# EAGLE design micro430 (EAGLE 5.11)
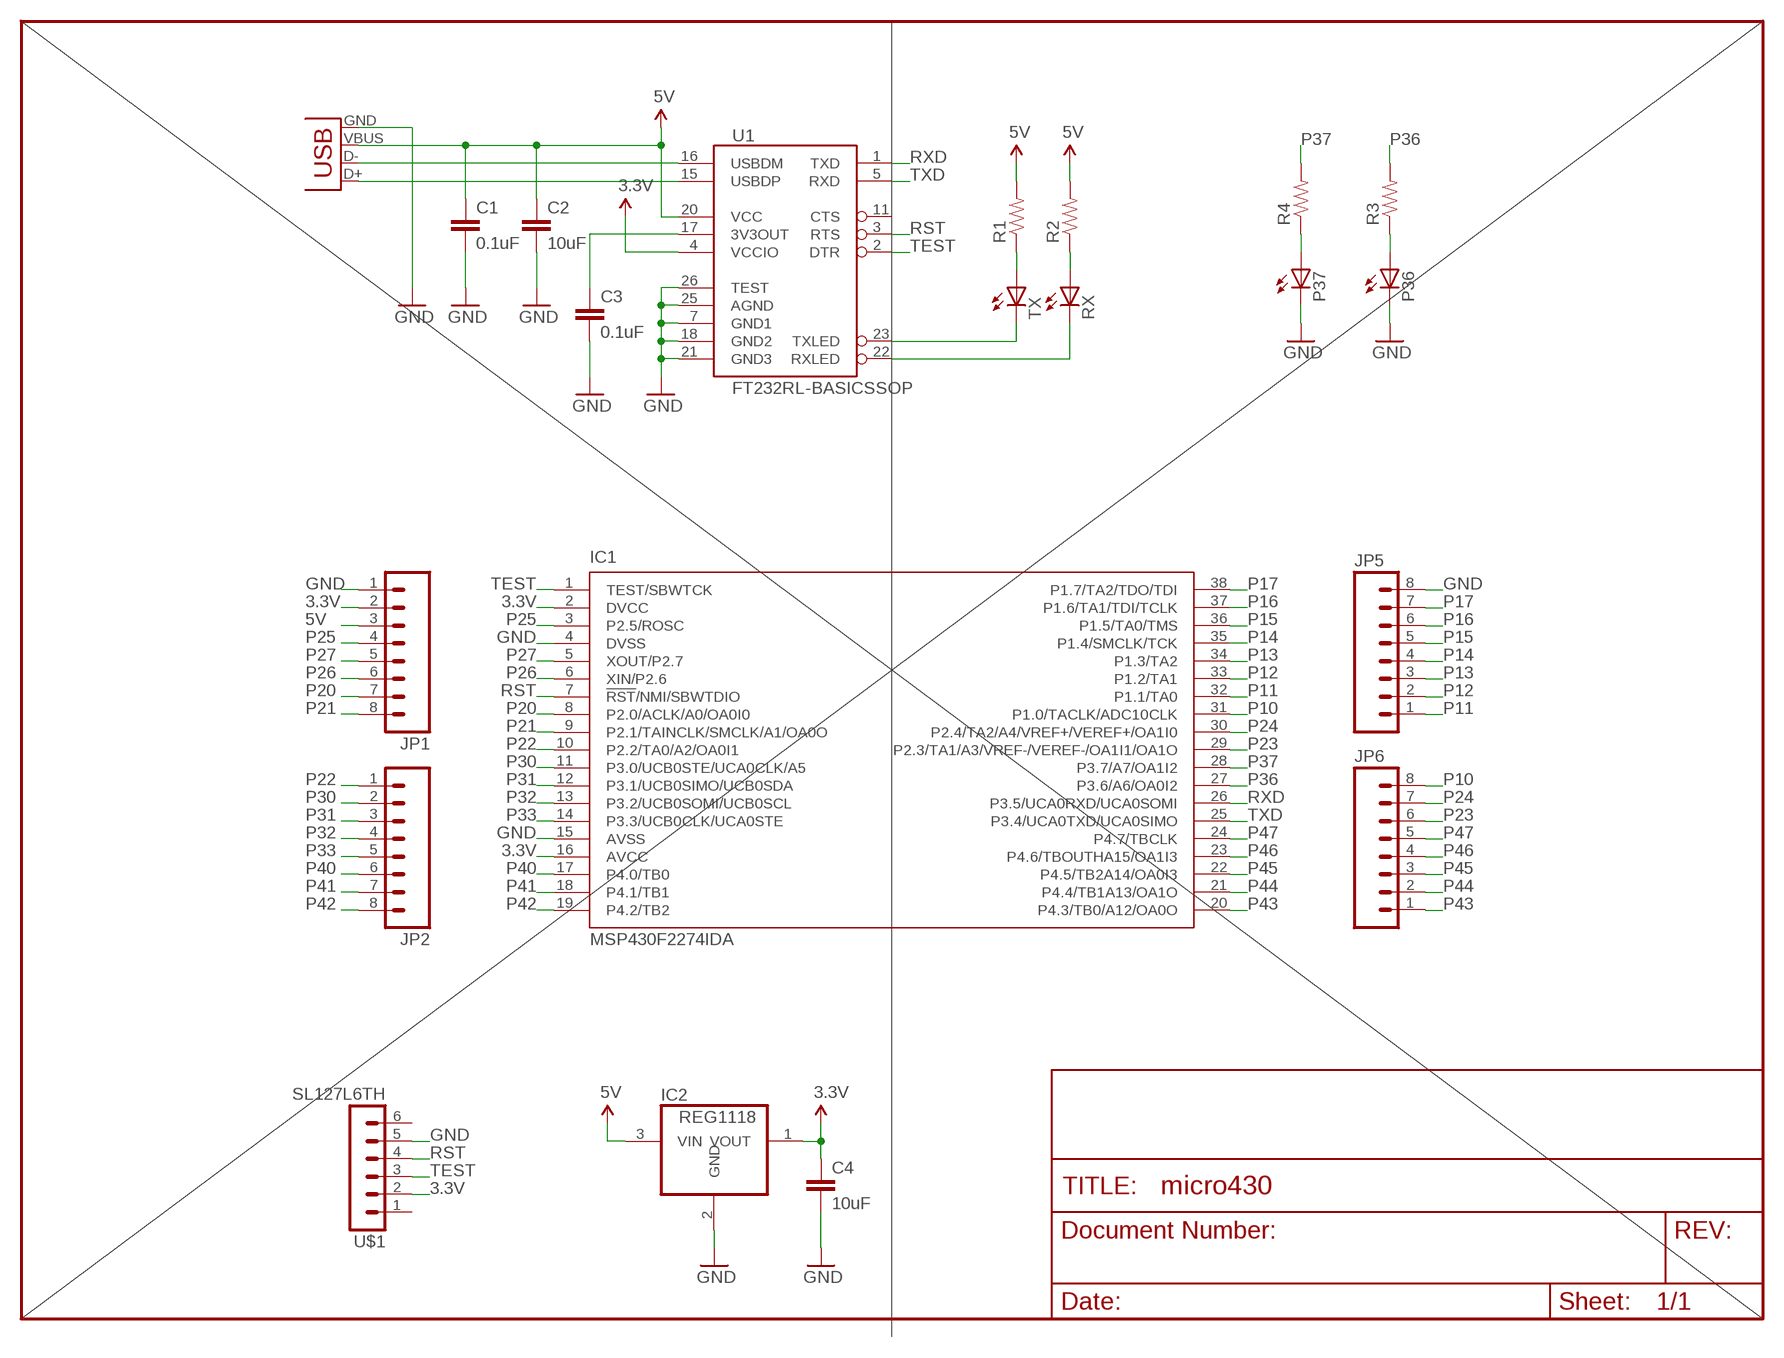
[diagram p0: schematic, sheet 1]

## Parts
C1  0.1uF  CAP0603-CAP  [0603-CAP]
C2  10uF  CAP0603-CAP  [0603-CAP]
C3  0.1uF  CAP0603-CAP  [0603-CAP]
C4  10uF  CAP0603-CAP  [0603-CAP]
IC1  MSP430F2274IDA  [TSSOP38_R-PDSO-G38-DA]
IC2  REG1118  [SOT223]
JP1  M081X08  [1X08]
JP2  M081X08  [1X08]
JP5  M081X08  [1X08]
JP6  M081X08  [1X08]
P36  LED0603  [LED-0603]
P37  LED0603  [LED-0603]
R1  RESISTOR0402-RES  [0402-RES]
R2  RESISTOR0402-RES  [0402-RES]
R3  RESISTOR0402-RES  [0402-RES]
R4  RESISTOR0402-RES  [0402-RES]
RX  LED0603  [LED-0603]
TX  LED0603  [LED-0603]
U1  FT232RL-BASICSSOP  [SSOP28DB]
U$1  SL127L6TH  [SL127L6_MPE]
X2  USB-MICROB  [USB-MICROB]

## Nets
3.3V: C4.1 IC1.2(DVCC) IC1.16(AVCC) IC2.1(VOUT) JP1.2 U1.4(VCCIO) U$1.2
5V: C1.1 C2.1 IC2.3(VIN) JP1.3 R1.2 R2.2 U1.20(VCC) X2.VBUS
GND: C1.2 C2.2 C3.2 C4.2 IC1.4(DVSS) IC1.15(AVSS) IC2.2(GND) JP1.1 JP5.8 P36.C P37.C U1.7(GND1) U1.18(GND2) U1.21(GND3) U1.25(AGND) U1.26(TEST) U$1.5 X2.GND
N$1: U1.15(USBDP) X2.D+
N$2: U1.16(USBDM) X2.D-
N$3: C3.1 U1.17(3V3OUT)
N$4: TX.C U1.23(TXLED)
N$5: RX.C U1.22(RXLED)
N$6: R1.1 TX.A
N$7: R2.1 RX.A
N$8: P37.A R4.1
N$9: P36.A R3.1
P10: IC1.31(P1.0/TACLK/ADC10CLK) JP6.8
P11: IC1.32(P1.1/TA0) JP5.1
P12: IC1.33(P1.2/TA1) JP5.2
P13: IC1.34(P1.3/TA2) JP5.3
P14: IC1.35(P1.4/SMCLK/TCK) JP5.4
P15: IC1.36(P1.5/TA0/TMS) JP5.5
P16: IC1.37(P1.6/TA1/TDI/TCLK) JP5.6
P17: IC1.38(P1.7/TA2/TDO/TDI) JP5.7
P20: IC1.8(P2.0/ACLK/A0/OA0I0) JP1.7
P21: IC1.9(P2.1/TAINCLK/SMCLK/A1/OA0O) JP1.8
P22: IC1.10(P2.2/TA0/A2/OA0I1) JP2.1
P23: IC1.29(P2.3/TA1/A3/VREF-/VEREF-/OA1I1/OA1O) JP6.6
P24: IC1.30(P2.4/TA2/A4/VREF+/VEREF+/OA1I0) JP6.7
P25: IC1.3(P2.5/ROSC) JP1.4
P26: IC1.6(XIN/P2.6) JP1.6
P27: IC1.5(XOUT/P2.7) JP1.5
P30: IC1.11(P3.0/UCB0STE/UCA0CLK/A5) JP2.2
P31: IC1.12(P3.1/UCB0SIMO/UCB0SDA) JP2.3
P32: IC1.13(P3.2/UCB0SOMI/UCB0SCL) JP2.4
P33: IC1.14(P3.3/UCB0CLK/UCA0STE) JP2.5
P36: IC1.27(P3.6/A6/OA0I2) R3.2
P37: IC1.28(P3.7/A7/OA1I2) R4.2
P40: IC1.17(P4.0/TB0) JP2.6
P41: IC1.18(P4.1/TB1) JP2.7
P42: IC1.19(P4.2/TB2) JP2.8
P43: IC1.20(P4.3/TB0/A12/OA0O) JP6.1
P44: IC1.21(P4.4/TB1A13/OA1O) JP6.2
P45: IC1.22(P4.5/TB2A14/OA0I3) JP6.3
P46: IC1.23(P4.6/TBOUTHA15/OA1I3) JP6.4
P47: IC1.24(P4.7/TBCLK) JP6.5
RST: IC1.7(!RST!/NMI/SBWTDIO) U1.3(RTS) U$1.4
RXD: IC1.26(P3.5/UCA0RXD/UCA0SOMI) U1.1(TXD)
TEST: IC1.1(TEST/SBWTCK) U1.2(DTR) U$1.3
TXD: IC1.25(P3.4/UCA0TXD/UCA0SIMO) U1.5(RXD)
Unconnected: U1.11(CTS) U$1.1 U$1.6

## Library data of the parts
C1-C3 = SparkFun:CAP: Capacitor Standard 0603 ceramic capacitor, and 0.1" leaded capacitor.
C4 = bear24rw_SparkFun:CAP: Capacitor Standard 0603 ceramic capacitor, and 0.1" leaded capacitor.
IC1 = texas:MSP430F22*4IDA: MIXED SIGNAL MICROCONTROLLER Source: http://focus.ti.com/lit/ds/symlink/msp430f2274.pdf; MPN: MSP430F2274IDA; OC_FARNELL: 1610179; OC_NEWARK: 28M6350
IC2 = burr-brown:REG1118: 800mA Low Dropout (LDO) Positive Regulator with Current Source and Sink Capability; MPN: REG1118-2.85/2K5G4; OC_FARNELL: unknown; OC_NEWARK: 14M2185
JP1 JP2 JP5 JP6 = bear24rw_SparkFun:M08: Header 8 Standard 8-pin 0.1" header. Use with straight break away headers (SKU : PRT-00116), right angle break away headers (PRT-00553), swiss pins (PRT-00743), machine pins (PRT-00117), and female headers (PRT-00115).
P36 P37 RX TX = SparkFun:LED: LEDs Standard schematic elements and footprints for 5mm, 3mm, 1206, and 0603 sized LEDs. 5mm - Spark Fun Electronics SKU : COM-00529 (and others)
R1-R4 = SparkFun:RESISTOR: Resistor Basic schematic elements and footprints for 0603, 1206, and PTH resistors.
U1 = SparkFun:FT232RL-BASIC: USB UART This is the simplified version of the FT232RL unit. Only what you need, nothing you don't. Spark Fun Electronics SKU : COM-00650
U$1 = bear24rw_susbfet:SL127L6TH
X2 = bear24rw_SparkFun:USB: USB Connectors USB-B-PTH is fully proven SKU : PRT-00139 USB-miniB is fully proven SKU : PRT-00587 USB-A-PCB is untested. USB-A-H is throughly reviewed, but untested. Spark Fun Electronics SKU : PRT-00437 USB-B-SMT is throughly reviewed, but untested. Needs silkscreen touching up. USB-A-S has not been used/tested USB-MB-H has not been used/tested

## Board
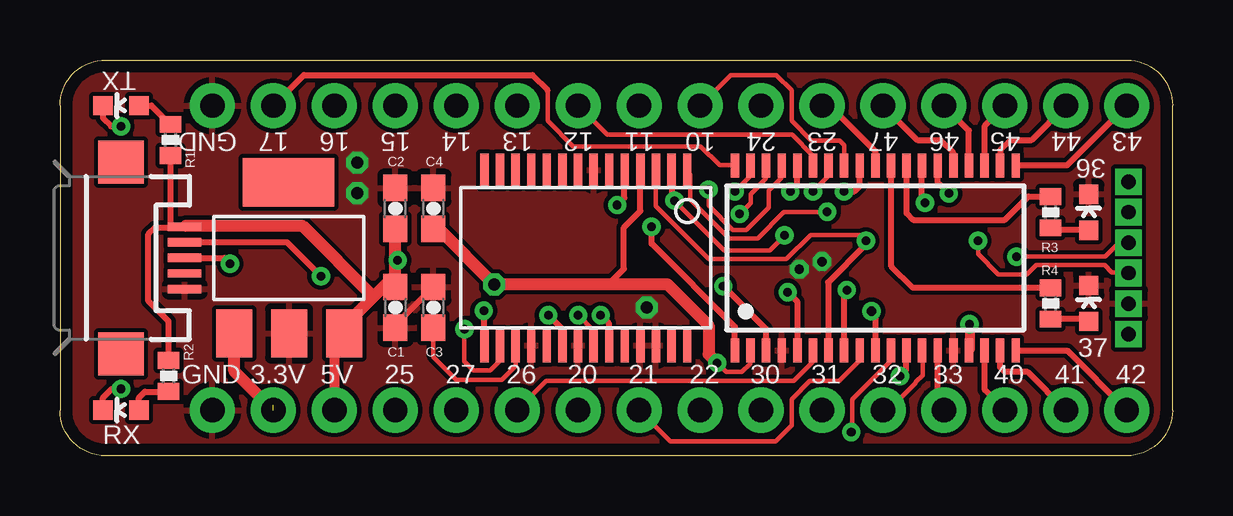
[diagram p1: board, top side]
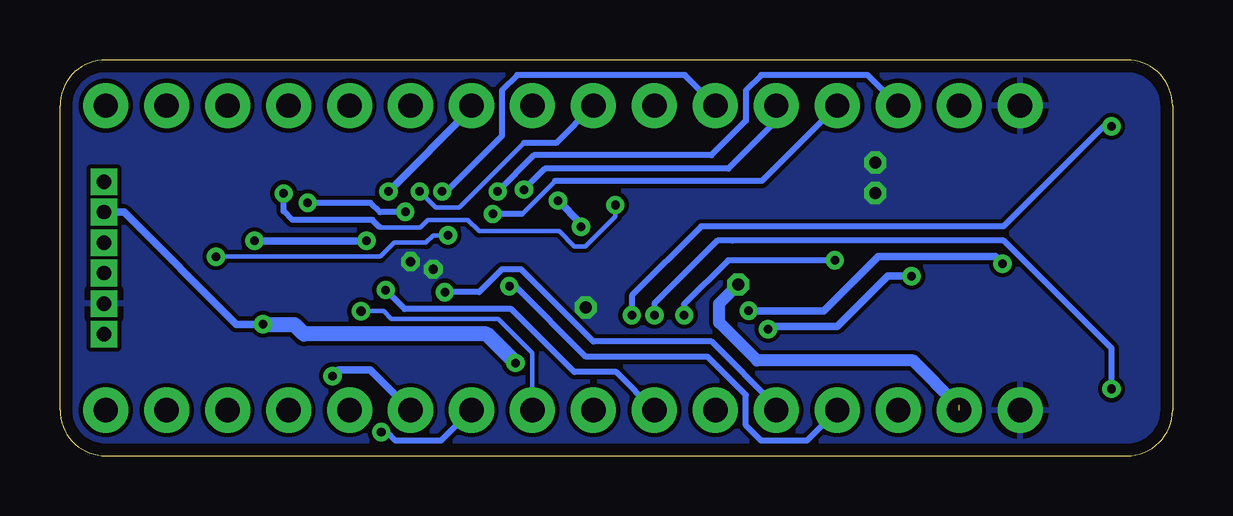
[diagram p2: board, bottom side, seen from below]

Size 46.35 x 16.51 mm. Coordinates in mm from the lower left corner, seen from the top.
Outline: 46.35,1.91 46.35,14.61 arc90 44.45,16.51 1.91,16.51 arc90 0,14.61 0,1.91 arc90 1.91,0 44.45,0 arc90 46.35,1.91
Copper layers (1*16): Top 0.0356mm / dielectric 1.5011mm / Bottom 0.0356mm
Design rules "SilverCircuits *": minimum track width 7mil, minimum drill 14mil, track to track 7mil, track to pad 7mil, pad to pad 7mil, via to via 7mil, smd to smd 0mil, copper to edge 20mil, drill to drill 8mil, minimum pad ring 10mil, minimum via ring 8mil, stop-mask expansion 4mil, vias tented up to drill 20mil, thermal gap 10mil

### Footprints (pad centres in the part's own frame; a part is rotated, then mirrored left to right if it is on the bottom)
0603-CAP = smd 1.1 x 1: 1 -0.85,0; 2 0.85,0
TSSOP38_R-PDSO-G38-DA = smd 0.35 x 1: 1 -5.85,-3.85; 2 -5.2,-3.85; 3 -4.55,-3.85; 4 -3.9,-3.85; 5 -3.25,-3.85; 6 -2.6,-3.85; 7 -1.95,-3.85; 8 -1.3,-3.85; 9 -0.65,-3.85; 10 0,-3.85; 11 0.65,-3.85; 12 1.3,-3.85; 13 1.95,-3.85; 14 2.6,-3.85; 15 3.25,-3.85; 16 3.9,-3.85; 17 4.55,-3.85; 18 5.2,-3.85; 19 5.85,-3.85; 20 5.85,3.85; 21 5.2,3.85; 22 4.55,3.85; 23 3.9,3.85; 24 3.25,3.85; 25 2.6,3.85; 26 1.95,3.85; 27 1.3,3.85; 28 0.65,3.85; 29 0,3.85; 30 -0.65,3.85; 31 -1.3,3.85; 32 -1.95,3.85; 33 -2.6,3.85; 34 -3.25,3.85; 35 -3.9,3.85; 36 -4.55,3.85; 37 -5.2,3.85; 38 -5.85,3.85
SOT223 = smd 1.499 x 2.007: 1 -2.261,-3.15; 2 0.025,-3.15; 3 2.311,-3.15 | smd 3.81 x 2.007: 4 0,3.15
1X08 = drill 1.016 pad 1.88 round: 1 0,0; 2 2.54,0; 3 5.08,0; 4 7.62,0; 5 10.16,0; 6 12.7,0; 7 15.24,0; 8 17.78,0
LED-0603 = smd 0.8 x 0.8: A 0,-0.75; C 0,0.75
0402-RES = smd 0.7 x 0.9: 1 -0.65,0; 2 0.65,0
SSOP28DB = smd 0.348 x 1.397: 1 -4.225,-3.656; 2 -3.575,-3.656; 3 -2.925,-3.656; 4 -2.275,-3.656; 5 -1.625,-3.656; 6 -0.975,-3.656; 7 -0.325,-3.656; 8 0.325,-3.656; 9 0.975,-3.656; 10 1.625,-3.656; 11 2.275,-3.656; 12 2.925,-3.656; 13 3.575,-3.656; 14 4.225,-3.656; 15 4.225,3.656; 16 3.575,3.656; 17 2.925,3.656; 18 2.275,3.656; 19 1.625,3.656; 20 0.975,3.656; 21 0.325,3.656; 22 -0.325,3.656; 23 -0.975,3.656; 24 -1.625,3.656; 25 -2.275,3.656; 26 -2.925,3.656; 27 -3.575,3.656; 28 -4.225,3.656
SL127L6_MPE = drill 0.6 pad 0.889 square: 1 0.005,0.07; 2 1.265,0.07; 3 2.545,0.07; 4 3.805,0.07; 5 5.085,0.07; 6 6.355,0.07
USB-MICROB = smd 0.35 x 1.4: D+ 0,2.65; D- -0.65,2.65; GND 1.3,2.65; ID 0.65,2.65; VBUS -1.3,2.65 | smd 1.8 x 1.9: MT1 -4,0; MT2 4,0

### Placement (x,y rotation side)
C1  13.97,6.19 270 top
C2  13.97,10.32 90 top
C3  15.56,6.19 90 top
C4  15.56,10.32 90 top
IC1  33.97,8.26 0 top
IC2  9.53,8.26 0 top
JP1  6.35,1.91 0 top
JP2  26.67,1.91 0 top
JP5  24.13,14.61 180 top
JP6  44.45,14.61 180 top
P36  42.86,10.16 0 top
P37  42.86,6.35 0 top
R1  4.6,13.18 270 top
R2  4.52,3.33 90 top
R3  41.27,10.16 90 top
R4  41.27,6.35 90 top
RX  2.54,1.91 90 top
TX  2.54,14.61 90 top
U1  21.91,8.26 180 top
U$1  44.45,11.43 270 top
X2  2.54,8.26 270 top

### Tracks (layer width: path | path; a pad name or v marks a point on that pad's centre or on a via)
3.3V  (via drill 0.36, 0.51)  (1 unrouted)
  Top 0.178: 37.9,4.42 IC1.16 | 28.75,3.83 28.42,3.49 27.76,3.49 v27.38,3.87 | 28.75,4.38 28.75,4.39 IC1.2 28.75,4.38 | 28.75,3.83 | 28.75,3.83 28.65,3.73 | 28.75,3.83 28.75,4.38
  Top 0.254: U1.4 24.18,10.21 23.5,9.53 23.5,7.8 22.86,7.16
  Top 0.406: v37.9,5.49 37.9,4.42
  Top 0.508: v27.38,3.87 27.03,4.23 27.03,5.43 25.29,7.16 22.86,7.16 18.59,7.16 18.12,7.16 v18.1,7.14 15.77,9.47 C4.1 | IC2.1 7.26,3.53 JP1.2
  Bottom 0.178: 44.5,10.16 U$1.2 | 37.82,5.46 v37.9,5.49
  Bottom 0.305: v37.9,5.49 39.01,5.49 43.69,10.16 44.5,10.16
  Bottom 0.508: 8.89,2.13 8.96,2.13 10.79,3.97 17.3,3.97 18.89,5.56 18.89,6.35 v18.1,7.14
  Bottom 0.635: v27.38,3.87 27.38,3.89 28.57,5.08 36.2,5.08 36.58,5.46 37.82,5.46
5V  (via drill 0.36)
  Top 0.178: 4.57,9.55 X2.VBUS | 4.62,12.52 R1.2 | X2.VBUS 4.62,9.63 | 13.97,9.45 C2.1 | 20.93,5.28 20.93,4.62 U1.20 | 11.84,5.41 IC2.3 11.81,5.03 11.43,4.65 | 13.89,7.47 C1.1 | X2.VBUS 5.26,9.6
  Top 0.254: 4.62,9.63 4.62,12.52 | v20.34,5.87 20.93,5.28 | 13.97,8.15 v14.07,8.15 | 4.57,9.55 4.55,9.53 3.97,9.53 3.68,9.24 3.68,6.45 4.52,5.61 R2.2
  Top 0.406: 11.43,4.65 JP1.3
  Top 0.508: 13.97,9.45 13.97,8.15 C1.1 | 13.06,6.63 13.89,7.47 | 13.06,6.63 11.84,5.41 | 5.26,9.6 10.08,9.6 13.06,6.63
  Bottom 0.254: v14.07,8.15 18.52,8.15 20.34,6.33 v20.34,5.87
GND  (via drill 0.38, 0.51)
  Top 0.178: C1.2 13.97,5.45
  Top 0.254: 13.97,5.45 C3.2
  other vias: 12.38,12.22 12.38,10.95 24.45,6.19 30.8,7.78 31.75,8.1
  pour Top: -2.54,-1.91 -2.54,18.41 53.34,18.41 53.34,-1.91
  pour Bottom: -1.27,-0.64 -1.27,17.14 52.07,17.14 52.07,-0.64
N$1  (via drill 0.36)
  Top 0.178: 17.68,4.62 U1.15
  Top 0.254: v17.66,6.05 17.68,4.62 | X2.D+ 6.84,8.26 v7.09,8.01
  Bottom 0.305: v17.66,6.05 14.53,6.05 12.27,8.31 7.38,8.31 v7.09,8.01
N$2  (via drill 0.36)
  Top 0.178: U1.16 18.31,4.6 18.31,3.96 17.92,3.57 17.22,3.57 16.85,3.94 v16.85,5.28 | X2.D- 5.21,8.91
  Top 0.254: 5.21,8.91 9.45,8.91 v10.87,7.49
  Bottom 0.305: v10.87,7.49 11.88,7.49 13.97,5.4 16.74,5.4 v16.85,5.28
N$3
  Top 0.178: U1.17 18.98,3.74 18.41,3.17 16.51,3.17 15.56,4.13 C3.1
N$4  (via drill 0.36)
  Top 0.178: 1.8,14.48 1.8,14.61 TX.C | 22.86,4.62 U1.23
  Top 0.254: v22.53,5.87 22.86,5.54 22.86,4.62 | v2.54,13.74 2.13,13.74 1.79,14.09 TX.C
  Bottom 0.254: v22.53,5.87 22.53,6.68 19.64,9.57 7.04,9.57 2.87,13.74 v2.54,13.74
N$5  (via drill 0.36)
  Top 0.178: v21.59,5.87 22.23,5.23 22.23,4.62 U1.22 | RX.C 1.78,1.93
  Top 0.254: v2.54,2.79 2.16,2.79 1.79,2.42 RX.C
  Bottom 0.254: v21.59,5.87 21.59,6.35 18.97,8.97 18.33,8.97 7.03,8.97 2.54,4.49 v2.54,2.79
N$6
  Top 0.254: TX.A 3.81,14.61 4.6,13.82 R1.1
N$7
  Top 0.178: RX.A 3.3,1.93 | 4.45,2.67 R2.1
  Top 0.254: 4.45,2.67 3.54,2.67 3.29,2.42 RX.A
N$8
  Top 0.254: R4.1 42.76,5.7 P37.A
N$9
  Top 0.178: 41.35,9.42 R3.1 | P36.A 42.85,9.42
  Top 0.254: 42.85,9.42 41.35,9.42
P10
  Top 0.178: 32.66,12.52 IC1.31 32.67,12.97 32.49,13.15 31.3,13.15 30.48,13.97 30.48,15.24 29.84,15.88 27.94,15.88 JP6.8
P11  (via drill 0.36)
  Top 0.178: v31.37,11.02 32,11.66 32,12.09 IC1.32
  Bottom 0.178: v31.37,11.02 30.71,10.36 29.72,10.36 27.03,13.05
  Bottom 0.254: 27.03,13.05 25.69,13.05 JP5.1
P12
  Top 0.178: IC1.33 31.37,12.52 30.5,13.39 22.81,13.39 JP5.2
P13  (via drill 0.36)
  Top 0.178: 30.71,12.09 IC1.34
  Top 0.254: 30.71,12.09 30.71,11.3 v30.43,11.02
  Bottom 0.254: v30.43,11.02 30.25,11.02 27.94,13.34 27.94,15.24 27.3,15.88 20.32,15.88 JP5.3
P14  (via drill 0.36)
  Top 0.178: v27.03,11.1 27.03,10.44 28.04,9.42 28.6,9.42 29.53,10.35 29.53,11.06 30.05,11.58 30.05,12.09 IC1.35
  Bottom 0.254: JP5.4 16.51,13.97 18.5,11.98 26.15,11.98 v27.03,11.1
P15  (via drill 0.36)
  Top 0.178: v28.32,10.08 28.78,10.54 28.78,10.92 29.41,11.56 29.41,12.09 IC1.36
  Bottom 0.178: 25.72,11.46 27.1,10.08
  Bottom 0.254: 27.1,10.08 v28.32,10.08 | 25.72,11.46 17.11,11.46 JP5.5
P16  (via drill 0.36)
  Top 0.178: v28.12,11.02 28.75,11.66 28.75,12.09 IC1.37
  Bottom 0.254: v28.12,11.02 26.61,12.54 19.21,12.54 17.78,13.97 17.78,15.24 17.14,15.88 12.7,15.88 JP5.6
P17
  Top 0.178: IC1.38 27.49,12.12 26.7,12.9 21.39,12.9 20.32,13.97 20.32,15.24
  Top 0.254: 20.32,15.24 19.68,15.88 10.16,15.88 JP5.7
P20  (via drill 0.36)
  Top 0.178: IC1.8
  Top 0.254: IC1.8 32.66,6.79 v32.78,6.92
  Bottom 0.254: v32.78,6.92 31.99,6.12 27.55,6.12 24.92,3.49 23.18,3.49 JP1.7
P21
  Top 0.178: JP1.8 25.43,0.61 29.82,0.61 30.48,1.27 30.48,2.36 31.24,3.12 32.46,3.12 33.3,3.96 33.3,4.39 IC1.9
P22  (via drill 0.38)
  Top 0.254: IC1.10 33.97,5.87 v33.81,6.03
  Bottom 0.178: v33.81,6.03 32.86,6.03 32.54,5.71 28.1,5.71 26.67,4.29 JP2.1
P23
  Top 0.178: IC1.29
  Top 0.254: IC1.29 33.96,12.71 32.07,14.61 JP6.6
P24  (via drill 0.36)
  Top 0.178: IC1.30 33.3,12.09
  Top 0.254: v32.66,11.02 33.09,11.02 33.34,11.27 33.32,11.29 IC1.30
  Bottom 0.305: v32.66,11.02 29.21,14.48 JP6.7
P25  (via drill 0.36)
  Top 0.178: IC1.3
  Top 0.254: IC1.3 29.41,5.3 v27.64,7.07
  Bottom 0.254: v27.64,7.07 27.39,7.07 24.45,4.13 19.37,4.13 17.78,2.54 17.78,1.27 17.14,0.64 15.24,0.64 JP1.4
P26
  Top 0.178: JP1.6 20.27,3.12 30.58,3.12 31.37,3.91 31.37,4.39 IC1.6
P27  (via drill 0.36)
  Top 0.178: 30.71,4.42 IC1.5
  Top 0.254: 30.71,4.42 30.71,6.44 v30.32,6.83
  Bottom 0.254: v30.32,6.83 28.89,6.83 27.94,7.78 27.15,7.78 24.13,4.76 19.21,4.76 16.51,2.06 JP1.5
P30  (via drill 0.36)
  Top 0.178: IC1.11 34.62,4.39 34.62,3.96 33.02,2.36 33.02,1.04 v32.97,0.99
  Bottom 0.254: v32.97,0.99 32.74,0.99 32.38,0.64 30.48,0.64 JP2.2
P31  (via drill 0.36)
  Top 0.178: 35.26,4.39 IC1.12
  Top 0.254: 35.26,4.39 35.26,3.58 v35,3.33
  Bottom 0.305: v35,3.33 34.75,3.58 33.43,3.58 JP2.3
P32
  Top 0.178: JP2.4 34.52,1.91 35.66,3.05 35.66,3.07 35.94,3.35 35.94,4.39 IC1.13
P33
  Top 0.178: 36.58,4.39 IC1.14
  Top 0.254: 36.58,4.39 36.58,2.16 JP2.5
P36
  Top 0.178: R3.2 | 35.28,12.09 IC1.27
  Top 0.254: R3.2 40.35,10.82 39.37,9.84 35.56,9.84 35.28,10.12 35.28,12.09
P37
  Top 0.178: R4.2 | 34.65,12.09 IC1.28
  Top 0.254: 34.65,12.09 34.65,7.9 35.53,7.01 R4.2
P40
  Top 0.178: 38.53,4.39 IC1.17
  Top 0.254: 38.53,4.39 38.53,2.74 JP2.6
P41
  Top 0.254: IC1.18 39.17,3.69 39.37,3.49 40.32,3.49 JP2.7
P42
  Top 0.178: IC1.19 39.83,4.39
  Top 0.254: 39.83,4.39 41.96,4.39 JP2.8
P43
  Top 0.178: IC1.20
  Top 0.254: IC1.20 41.96,12.12 JP6.1
P44
  Top 0.178: IC1.21 39.19,12.12
  Top 0.254: 39.19,12.12 39.19,12.76 39.61,13.18 40.48,13.18 JP6.2
P45
  Top 0.178: IC1.22 38.53,12.12
  Top 0.254: 38.53,12.12 38.53,13.77 JP6.3
P46
  Top 0.254: IC1.23 37.87,13.56 JP6.4
P47
  Top 0.178: 37.21,12.52 IC1.24
  Top 0.254: 37.21,12.52 37.21,12.64 36.67,13.18 35.72,13.18 JP6.5
RST  (via drill 0.36)
  Top 0.178: 32,4.42 IC1.7 | U$1.4 44.5,7.64 43.83,7.64 43.52,7.95 40.67,7.95 40.29,7.57 39.1,7.57 38.25,8.41 v38.25,8.97 | v33.58,8.97 33.34,9.21 31.27,9.21 30.27,8.2 27.04,8.2 24.83,10.41 U1.3
  Top 0.254: 32,4.42 32,7.24 33.58,8.81 v33.58,8.97
  Bottom 0.305: v33.58,8.97 v38.25,8.97
RXD  (via drill 0.36)
  Top 0.178: 35.92,12.52 IC1.26 | U1.1 26.11,11.89 26.26,11.73 26.26,10.69 27.89,9.07 29.07,9.07 30.16,10.16 31.95,10.16 v31.97,10.18
  Top 0.254: IC1.26 35.92,10.67 v36.04,10.55
  Bottom 0.178: v31.97,10.18 31.98,10.16
  Bottom 0.254: 31.98,10.16 33.02,10.16 33.41,10.55 v36.04,10.55
TEST  (via drill 0.36)
  Top 0.178: IC1.1 | v39.85,8.31 43.56,8.31 44.12,8.87 44.5,8.87 U$1.3 | v30.19,9.2 29.57,8.57 27.67,8.57 v25.6,10.64 25.5,10.74 | 25.5,11.89 U1.2
  Top 0.254: IC1.1 28.12,5.38 24.65,8.85 v24.65,9.56 | 25.5,10.74 25.5,11.89
  Bottom 0.178: v39.85,8.31 33.02,8.31 32.44,8.89 31.11,8.89 30.81,9.2 v30.19,9.2
  Bottom 0.305: v24.65,9.56 24.65,9.69 v25.6,10.64
TXD  (via drill 0.36)
  Top 0.178: 36.58,12.09 IC1.25 | 23.52,11.89 U1.5
  Top 0.254: 23.52,11.89 23.52,10.76 v23.22,10.46 | 36.58,12.09 36.58,11.4 v37.03,10.94
  Bottom 0.178: v23.22,10.46 23.22,9.98 24.46,8.74 24.93,8.74 25.56,9.37 28.89,9.37 29.37,9.84 31.04,9.84 31.35,9.53 33.05,9.53 33.05,9.55
  Bottom 0.254: 33.05,9.55 33.34,9.84 36.67,9.84 37.03,10.2 v37.03,10.94

### Text on the board
tNames: GND | 17 | 16 | 15 | 14 | 13 | 12 | 11 | 10 | 24 | 23 | 47 | 46 | 45 | 44 | 43 | 36 | 37 | GND | 3.3V | 5V | 25 | 27 | 26 | 20 | 21 | 22 | 30 | 31 | 32 | 33 | 40 | 41 | 42